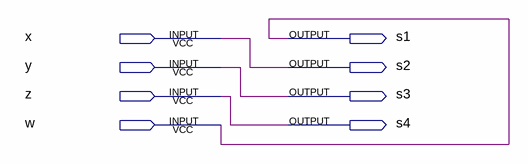
[diagram p0: schematic sheet]
// Quartus schematic rotate1.bdf as structural Verilog: 0 symbols, 8 pins
module rotate1 (
  input  x,
  input  y,
  input  z,
  input  w,
  output s1,
  output s2,
  output s3,
  output s4
);


  assign s1 = w;
  assign s2 = x;
  assign s3 = y;
  assign s4 = z;
endmodule
